# Altium schematic sheet Project_information.SchDoc: =project_title
size Tabloid; ENG_APP_DATE: --/--/--; DSN_APP_DATE: --/--/--; CHK_APP_DATE: --/--/--; CompanyName: Luxonis Holding; Organization: Luxonis Holding; Address1: 1925 Harmony Park Drive; Address2: Westminster, CO; Address3: 80234; Address4: United States; SheetNumber: 1; SheetTotal: 2
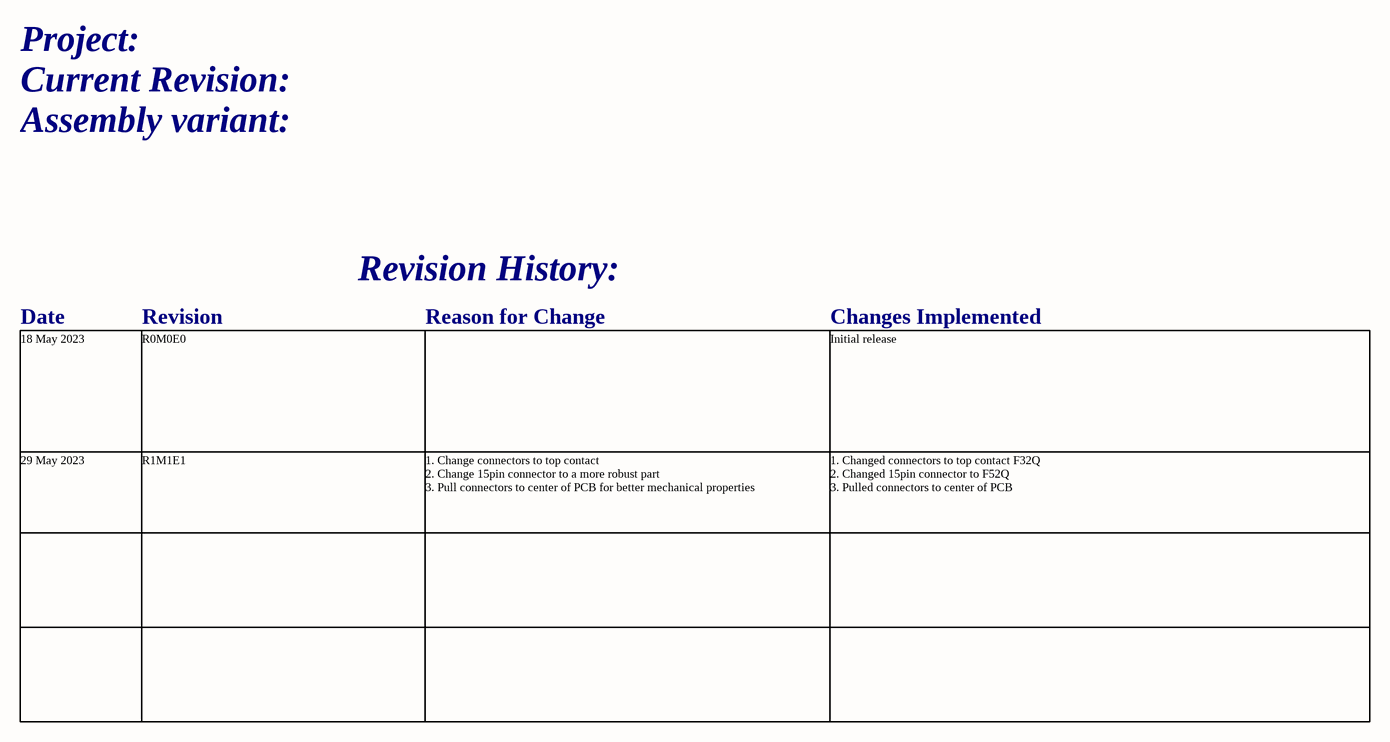
[diagram p0: Project_information.SchDoc]

## Notes on the sheet
- Project:
- Current Revision:
- Assembly variant:
- Revision History:
- Date
- Revision
- Reason for Change
- Changes Implemented
- 18 May 2023
- R0M0E0
- Initial release
- 29 May 2023
- R1M1E1
- 1. Change connectors to top contact
  2. Change 15pin connector to a more robust part
  3. Pull connectors to center of PCB for better mechanical properties
- 1. Changed connectors to top contact F32Q
  2. Changed 15pin connector to F52Q
  3. Pulled connectors to center of PCB
- Title
- Size:
- Date:
- Tabloid
- Number:
- Time:
- Revision:
- Sheet
- of
- Drawn by: